# Altium project V2_UMRT_FlightComputer_Prototype_2019.PrjPcb
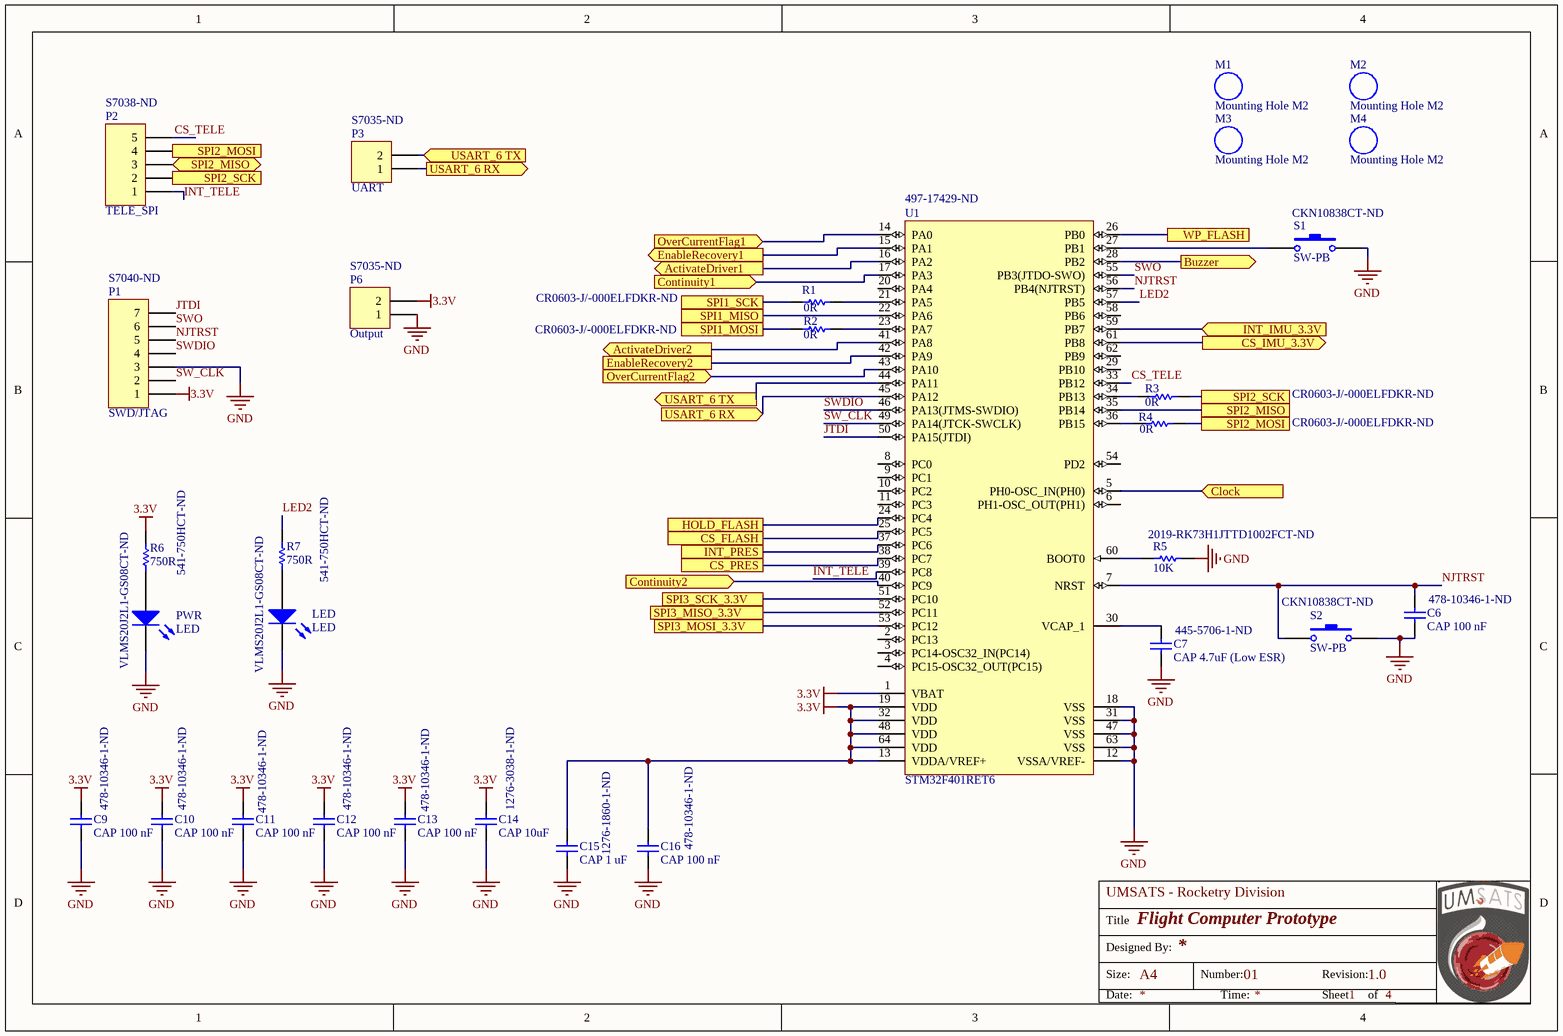
[diagram p0: Controller.SchDoc]
5 sheets, 97 parts. Net scope: flat (ports and power ports of the same name join across sheets).
Board file: PCB_Prototype.PcbDoc
Sheets:
  Controller.SchDoc
  UART-to-USB.SchDoc
  Sensors.SchDoc
  Recovery.SchDoc
  Misc.SchDoc

## Sheet Controller.SchDoc: Flight Computer Prototype
size A4; Organization: Altium Limited; Address1: L3, 12a Rodborough Rd; Address2: Frenchs Forest; Address3: NSW; Address4: Australia 2086; Revision: 1.0; SheetNumber: 1; SheetTotal: 4

### Parts
C6  CAP 100 nF  Supplier Part Number 1: 478-10346-1-ND  [06035C104KAT4A]
C7  CAP 4.7uF (Low ESR)  Supplier Part Number 1: 445-5706-1-ND  [CGA5L1X7R1E475K160AC]
C9  CAP 100 nF  Supplier Part Number 1: 478-10346-1-ND  [06035C104KAT4A]
C10  CAP 100 nF  Supplier Part Number 1: 478-10346-1-ND  [06035C104KAT4A]
C11  CAP 100 nF  Supplier Part Number 1: 478-10346-1-ND  [06035C104KAT4A]
C12  CAP 100 nF  Supplier Part Number 1: 478-10346-1-ND  [06035C104KAT4A]
C13  CAP 100 nF  Supplier Part Number 1: 478-10346-1-ND  [06035C104KAT4A]
C14  CAP 10uF  Supplier Part Number 1: 1276-3038-1-ND  [CL31A106KAHNFNE]
C15  CAP 1 uF  Supplier Part Number 1: 1276-1860-1-ND  [CL10A105KB8NNNC]
C16  CAP 100 nF  Supplier Part Number 1: 478-10346-1-ND  [06035C104KAT4A]
LED  LED  Supplier Part Number 1: VLMS20J2L1-GS08CT-ND  [Vishay VLMx20 Low Current Mini SMD LED]
M1  Mounting Hole M2  [Mounting Hole M2]
M2  Mounting Hole M2  [Mounting Hole M2]
M3  Mounting Hole M2  [Mounting Hole M2]
M4  Mounting Hole M2  [Mounting Hole M2]
P1  SWD/JTAG  Supplier Part Number 1: S7040-ND  [HDR1X7]
P2  TELE_SPI  Supplier Part Number 1: S7038-ND  [HDR1X5]
P3  UART  Supplier Part Number 1: S7035-ND  [HDR1X2]
P6  Output  Supplier Part Number 1: S7035-ND  [HDR1X2]
PWR  LED  Supplier Part Number 1: VLMS20J2L1-GS08CT-ND  [Vishay VLMx20 Low Current Mini SMD LED]
R1  0R  Supplier Part Number 1: CR0603-J/-000ELFDKR-ND  [CR0603-J/-000ELF]
R2  0R  Supplier Part Number 1: CR0603-J/-000ELFDKR-ND  [CR0603-J/-000ELF]
R3  0R  Supplier Part Number 1: CR0603-J/-000ELFDKR-ND  [CR0603-J/-000ELF]
R4  0R  Supplier Part Number 1: CR0603-J/-000ELFDKR-ND  [CR0603-J/-000ELF]
R5  10K  Supplier Part Number 1: 2019-RK73H1JTTD1002FCT-ND  [RK73H1JTTD1002F]
R6  750R  Supplier Part Number 1: 541-750HCT-ND  [CRCW0603750RFKEA]
R7  750R  Supplier Part Number 1: 541-750HCT-ND  [CRCW0603750RFKEA]
S1  SW-PB  Supplier Part Number 1: CKN10838CT-ND  [PTS530GG065SMTRLFS]
S2  SW-PB  Supplier Part Number 1: CKN10838CT-ND  [PTS530GG065SMTRLFS]
U1  STM32F401RET6  Supplier Part Number 1: 497-17429-ND  [STM-LQFP64_N]

### Ports
ActivateDriver1 (out), ActivateDriver2 (out), Buzzer (out), Clock (in), Continuity1 (in), Continuity2 (in), CS_FLASH, CS_IMU_3.3V (out), CS_PRES, EnableRecovery1 (out), EnableRecovery2, HOLD_FLASH, INT_IMU_3.3V (in), INT_PRES, OverCurrentFlag1 (in), OverCurrentFlag2 (in), SPI1_MISO, SPI1_MOSI, SPI1_SCK, SPI2_MISO, SPI2_MISO (bidir), SPI2_MOSI, SPI2_MOSI (in), SPI2_SCK, SPI2_SCK (in), SPI3_MISO_3.3V, SPI3_MOSI_3.3V, SPI3_SCK_3.3V, USART_6 RX (in), USART_6 RX (out), USART_6 TX (in), USART_6 TX (out), WP_FLASH

### Nets
3.3V: C9.1 C10.1 C11.1 C12.1 C13.1 C14.2 C15.1 C16.1 P1.1 P6.2 R6.2 U1.1(VBAT) U1.13(VDDA/VREF+) U1.19(VDD) U1.32(VDD) U1.48(VDD) U1.64(VDD)
GND: C6.2 C7.2 C9.2 C10.2 C11.2 C12.2 C13.2 C14.1 C15.2 C16.2 LED.2(K) P1.3 P6.1 PWR.2(K) R5.2 S1.2 S2.2 U1.12(VSSA/VREF-) U1.18(VSS) U1.31(VSS) U1.47(VSS) U1.63(VSS)
CS_TELE: P2.5 U1.33(PB12)
INT_TELE: P2.1 U1.39(PC8)
JTDI: P1.7 U1.50(PA15(JTDI))
LED2: R7.2 U1.57(PB5)
NJTRST: C6.1 P1.5 S2.1 U1.7(NRST) U1.56(PB4(NJTRST))
SW_CLK: P1.2 U1.49(PA14(JTCK-SWCLK))
SWDIO: P1.4 U1.46(PA13(JTMS-SWDIO))
SWO: P1.6 U1.55(PB3(JTDO-SWO))
NetC7_1: C7.1 U1.30(VCAP_1)
NetComp1_4: U1.17(PA3) ; port Continuity1
NetComp2_4: U1.40(PC9) ; port Continuity2
NetDriver1_1: U1.16(PA2) ; port ActivateDriver1
NetDriver1_2: U1.15(PA1) ; port EnableRecovery1
NetDriver1_3: U1.14(PA0) ; port OverCurrentFlag1
NetDriver2_1: U1.41(PA8) ; port ActivateDriver2
NetDriver2_2: U1.42(PA9) ; port EnableRecovery2
NetDriver2_3: U1.43(PA10) ; port OverCurrentFlag2
NetFLASH_1: U1.25(PC5) ; port CS_FLASH
NetFLASH_3: U1.26(PB0) ; port WP_FLASH
NetFLASH_5: R2.1 ; port SPI1_MOSI
NetFLASH_6: R1.1 ; port SPI1_SCK
NetFLASH_7: U1.24(PC4) ; port HOLD_FLASH
NetLED_1: LED.1(A) R7.1
NetP2_2: P2.2 R3.2 ; port SPI2_SCK
NetP2_3: P2.3 U1.35(PB14) ; port SPI2_MISO
NetP2_4: P2.4 R4.2 ; port SPI2_MOSI
NetP3_1: P3.1 U1.45(PA12) ; port USART_6 RX
NetP3_2: P3.2 U1.44(PA11) ; port USART_6 TX
NetPRES_6: U1.38(PC7) ; port CS_PRES
NetPRES_7: U1.37(PC6) ; port INT_PRES
NetPWR_1: PWR.1(A) R6.1
NetR1_2: R1.2 U1.21(PA5)
NetR2_2: R2.2 U1.23(PA7)
NetR3_1: R3.1 U1.34(PB13)
NetR4_1: R4.1 U1.36(PB15)
NetR5_1: R5.1 U1.60(BOOT0)
NetR12_2: U1.22(PA6) ; port SPI1_MISO
NetR33_1: U1.28(PB2) ; port Buzzer
NetS1_1: S1.1 U1.27(PB1)
NetU1_5: U1.5(PH0-OSC_IN(PH0)) ; port Clock
NetU1_51: U1.51(PC10) ; port SPI3_SCK_3.3V
NetU1_52: U1.52(PC11) ; port SPI3_MISO_3.3V
NetU1_53: U1.53(PC12) ; port SPI3_MOSI_3.3V
NetU1_59: U1.59(PB7) ; port INT_IMU_3.3V
NetU1_61: U1.61(PB8) ; port CS_IMU_3.3V

Not connected (* = marked no-connect by the designer): U1 2(PC13) 3(PC14-OSC32_IN(PC14)) 4(PC15-OSC32_OUT(PC15)) 6(PH1-OSC_OUT(PH1)) 8(PC0) 9(PC1) 10(PC2) 11(PC3) 20(PA4) 29(PB10) 54(PD2) 58(PB6) 62(PB9)

### Notes on the sheet
- Title
- UMSATS - Rocketry Division
- Designed By:
- Size:
- A4
- Number:
- 01
- Revision:
- Date:
- Time:
- Sheet
- of

### Library data of the parts
C6 C7 C9-C16 = Cap: Capacitor; Published: 8-Jun-2000; LatestRevisionDate: 17-Jul-2002; LatestRevisionNote: Re-released for DXP Platform.; Publisher: Altium Limited; Supplier 1: Digi-Key
  C14: PackageReference: RAD-0.3; PackageDescription: Radial Cap, Thru-Hole; 2 Leads; 0.3 in Pin Spacing; Value: 10uF
LED PWR = LED2: Typical RED, GREEN, YELLOW, AMBER GaAs LED; Published: 8-Jun-2000; LatestRevisionDate: 17-Jul-2002; LatestRevisionNote: Re-released for DXP Platform.; PackageVersion: Feb-2002; PackageReference: 3.2X1.6X1.1; Publisher: Altium Limited; PackageDescription: SM LED; 2 Flat Leads; Supplier 1: Digi-Key
P1 = Header 7: Header, 7-Pin; LatestRevisionDate: 17-Jul-2002; LatestRevisionNote: Re-released for DXP Platform.; Publisher: Altium Limited; Supplier 1: Digi-Key
P2 = Header 5: Header, 5-Pin; LatestRevisionDate: 17-Jul-2002; LatestRevisionNote: Re-released for DXP Platform.; Publisher: Altium Limited; Supplier 1: Digi-Key
P3 P6 = Header 2: Header, 2-Pin; LatestRevisionDate: 17-Jul-2002; LatestRevisionNote: Re-released for DXP Platform.; Publisher: Altium Limited; Supplier 1: Digi-Key
R1-R7 = Res1: Resistor; Value: 1K; Published: 8-Jun-2000; LatestRevisionDate: 17-Jul-2002; LatestRevisionNote: Re-released for DXP Platform.; PackageReference: AXIAL-0.3; Publisher: Altium Limited; PackageDescription: Axial Device, Thru-Hole; 2 Leads; 0.3 in Pin Spacing; Supplier 1: Digi-Key
S1 S2 = SW-PB: Switch; Published: 24-Mar-1999; LatestRevisionDate: 17-Jul-2002; LatestRevisionNote: Re-released for DXP Platform.; PackageReference: SPST-2; Publisher: Altium Limited; PackageDescription: Switch; 2 Leads; Supplier 1: Digi-Key
U1 = STM32F401RET6: ARM Cortex-M4 32-bit MCU+FPU, 512 KB Flash, 96 KB Internal RAM, 50 I/Os, 64-Pin LQFP, -40 to 85 degC, Tray; Supply Voltage(Vcc) min (V): 1.7; Internal RAM Size (kB): 96; I/Os (High Current): 50; Operating Frequency(F) (Processor speed) (MHz): 84; FLASH Size (Prog) (kB): 512; Package Reference: 64-Pin Low-profile Quad Flat Package, Body 10 x 10 mm, Pitch 0.5 mm; Packing: Tray; DatasheetVersion: Rev. 3; Mounting Technology: Surface Mount; ComponentLink1Description: Manufacturer URL; Package Description: LQFP64; Core: ARM Cortex-M4; ComponentLink1URL: http://www.st.com/; ComponentLink2URL: http://www.st.com/st-web-ui/static/active/en/resource/technical/document/datasheet/DM00102166.pdf; ComponentLink2Description: Datasheet; Supplier 1: Digi-Key

## Sheet UART-to-USB.SchDoc
size A
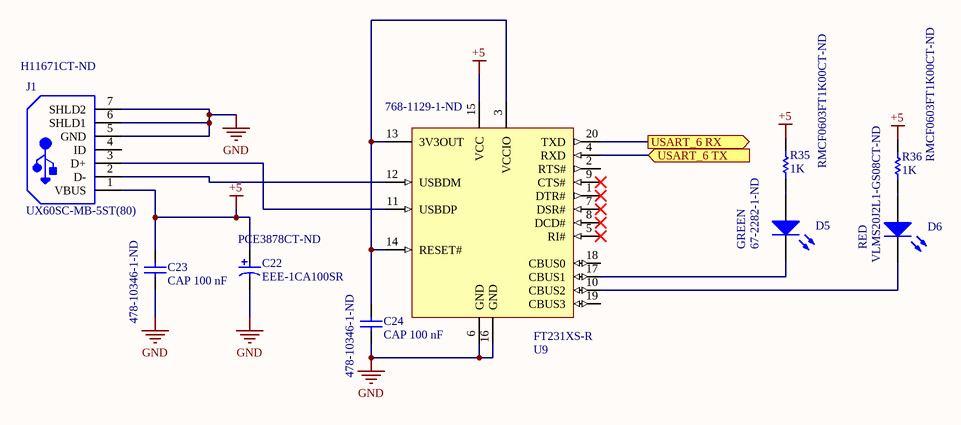
[diagram p1: UART-to-USB.SchDoc]

### Parts
C22  EEE-1CA100SR  Supplier Part Number 1: PCE3878CT-ND  [PNSC-EEE1CA100SR_L]
C23  CAP 100 nF  Supplier Part Number 1: 478-10346-1-ND  [06035C104KAT4A]
C24  CAP 100 nF  Supplier Part Number 1: 478-10346-1-ND  [06035C104KAT4A]
D5  GREEN  Supplier Part Number 1: 67-2282-1-ND  [Vishay VLMx20 Low Current Mini SMD LED]
D6  RED  Supplier Part Number 1: VLMS20J2L1-GS08CT-ND  [Vishay VLMx20 Low Current Mini SMD LED]
J1  UX60SC-MB-5ST(80)  Supplier Part Number 1: H11671CT-ND  [HIRO-UX60SC-MB-5ST(80)_V]
R35  1K  Supplier Part Number 1: RMCF0603FT1K00CT-ND  [CR0603-J/-000ELF]
R36  1K  Supplier Part Number 1: RMCF0603FT1K00CT-ND  [CR0603-J/-000ELF]
U9  FT231XS-R  Supplier Part Number 1: 768-1129-1-ND  [SSOP-20_L]

### Ports
USART_6 RX (out), USART_6 TX (in)

### Nets
+5: C22.1 C23.1 J1.1(VBUS) R35.2 R36.2 U9.15(VCC)
GND: C22.2 C23.2 C24.2 J1.5(GND) J1.6(SHLD1) J1.7(SHLD2) U9.6(GND) U9.16(GND)
NetC24_1: C24.1 U9.3(VCCIO) U9.13(3V3OUT) U9.14(RESET#)
NetD5_1: D5.1(A) R35.1
NetD5_2: D5.2(K) U9.17(CBUS1)
NetD6_1: D6.1(A) R36.1
NetD6_2: D6.2(K) U9.10(CBUS2)
NetJ1_2: J1.2(D-) U9.12(USBDM)
NetJ1_3: J1.3(D+) U9.11(USBDP)
NetP3_1: U9.20(TXD) ; port USART_6 RX
NetP3_2: U9.4(RXD) ; port USART_6 TX

Not connected (* = marked no-connect by the designer): J1 4(ID); U9 1(DTR#)* 2(RTS#) 5(RI#)* 7(DSR#)* 8(DCD#)* 9(CTS#)* 18(CBUS0) 19(CBUS3)

### Library data of the parts
C22 = CMP-2000-06199-1: Aluminum Electrolytic Capacitor, 10 uF, +/- 20%, -40 to 85 degC, 2-Pin SMD, RoHS, Tape and Reel; Manufacturer: Panasonic; Lead Length: 1.8mm; No. of Pins: 2; Ripple Current Frequency: 120Hz; Ripple Current Temperature: 85°C; External Depth: 4.3mm; Operating Lifetime: 2000h; Power Factor: 0.16; Lead Cross-section Width: 0.65mm; Product Range: PANASONIC-SSeries; Voltage Rating V DC: 16V; Leakage Current: 3µA; Ripple Current AC: 28mA; AE Capacitor Case: RadialCan-SMD; Capacitance: 10µF; Lifetime @ Temperature: 2000hours@85°C; External Length / Height: 5.4mm; SVHC: NoSVHC(16-Dec-2013); Packaging: CutTape; Series: VS; Package Description: 2-Pin Surface Mount Device, Body 4.5 x 4.5 mm; Tolerance -: 20%; Capacitor Terminals: SMD; Lead Spacing: 1mm; Package / Case: B; Capacitance Tolerance: ±20%; Operating life Time: 2000h; Tape Width: 12mm; Power Factor Frequency: 120Hz; Voltage Rating: 16V; Diameter: 4mm; Operating Temperature Max: 85°C; Datasheet URL: https://datasheet.ciiva.com/19458/1355487-19458346.pdf; Capacitor Mounting: SMD; External Width: 4.3mm; Operating Life Temperature: 85°C; Capacitance Tolerance ±: ±20%; Package Reference: EEE1CA100SR; AC Ripple Current: 28mA; Tolerance +: 20%; Height: 5.4mm; Datasheet Version: 04/2005; Operating Temperature Min: -40°C; Capacitor Case Style: RadialCan-SMD; Mounting Technology: SurfaceMount; Operating Temperature Range: -40°Cto+85°C; Manufacturer URL: http://www.panasonic.com/; Life Time @ Temperature: 2000hours@85°C; Supplier 1: Digi-Key
C23 C24 = Cap: Capacitor; Published: 8-Jun-2000; LatestRevisionDate: 17-Jul-2002; LatestRevisionNote: Re-released for DXP Platform.; Publisher: Altium Limited; Supplier 1: Digi-Key
D5 D6 = LED2: as LED on sheet Controller; Published: 8-Jun-2000; LatestRevisionDate: 17-Jul-2002; LatestRevisionNote: Re-released for DXP Platform.; PackageVersion: Feb-2002; PackageReference: 3.2X1.6X1.1; Publisher: Altium Limited; PackageDescription: SM LED; 2 Flat Leads; Supplier 1: Digi-Key
J1 = CMP-2000-07376-1: Mini-B Connector, SMT Mount Receptacle Meeting Requirement of USB 2.0 Standard, 5 V, 1 A, -30 to 75 degC, 5-Pin SMD, RoHS, Tape and Reel; Manufacturer: Hirose Electric; Product Length (mm): 7.7mm; Voltage Rating Max: 5VAC; Number of Contacts: 5POS; Number of Ports: 1Port; Product Height (mm): 3.95mm; Product Depth (mm): 7mm; Pitch (mm): 0.8mm; Gender: RCP; Current Rating (Max): 1A; DELETED: Compliant; Product Diameter (mm): NotRequiredmm; Body Orientation: RightAngle; Operating Temp Range: -30Cto75C; Packaging: TapeandReel; Termination Method: Solder; Number of Terminals: 5; Package Description: 5-Pin Surface Mount Device, Body 7.7 x 7 mm, Pitch 0.8 mm; Mounting Technology: SurfaceMount; Contact Material: CopperAlloy; Package Reference: UX60SC-MB-5ST(80); Operating Temperature Min Deg. C: -30C; Housing Material: Synthetic; Operating Temperature Max Deg. C: 75C; Manufacturer URL: https://www.hirose.com; Datasheet Version: 04/2008; Type: Mini-USB; Datasheet URL: https://datasheet.ciiva.com/4598/e24000153-34949-4598883.pdf; Contact Plating: Gold; Mounting Style: ThroughHole; Supplier 1: Digi-Key
R35 R36 = Res1: Resistor; Published: 8-Jun-2000; LatestRevisionDate: 17-Jul-2002; LatestRevisionNote: Re-released for DXP Platform.; PackageReference: AXIAL-0.3; Publisher: Altium Limited; PackageDescription: Axial Device, Thru-Hole; 2 Leads; 0.3 in Pin Spacing; Value: 1K; Supplier 1: Digi-Key
U9 = CMP-0248-00024-2: USB to Full-Handshake UART Interface Chip, UHCI/OHCI/EHCI Compatible, USB 2.0 Compatible, -40 to +85 degC, 20-Pin SSOP, Pb-Free, Tape and Reel; Manufacturer: FTDI; PackageVersion: Feb-13; PackageReference: SSOP-20; ComponentLink1Description: Manufacturer URL; ComponentLink2Description: Datasheet; PackageDescription: 20-Pin Small Outline Package, 8.6 x 3.9 mm Body, 0.635 mm Pitch; ComponentLink3URL: www.ftdichip.com/Products/ICs/FT231X.html; PartNumber: FT231XS-R; DatasheetVersion: ver 1.2, Feb-2013; ComponentLink2URL: http://www.ftdichip.com/Support/Documents/DataSheets/ICs/DS_FT231X.pdf; Code_JEDEC: MO-137-AD; ComponentLink3Description: FT231X Product Page; RevisionNote: DatasheetVersion updated to 1.2 Feb-2013; ComponentLink1URL: http://www.ftdichip.com/; Supplier 1: Digi-Key

## Sheet Sensors.SchDoc: Flight Computer Prototype
size A4; Organization: Altium Limited; Address1: L3, 12a Rodborough Rd; Address2: Frenchs Forest; Address3: NSW; Address4: Australia 2086; Revision: 1.0; SheetNumber: 2; SheetTotal: 4
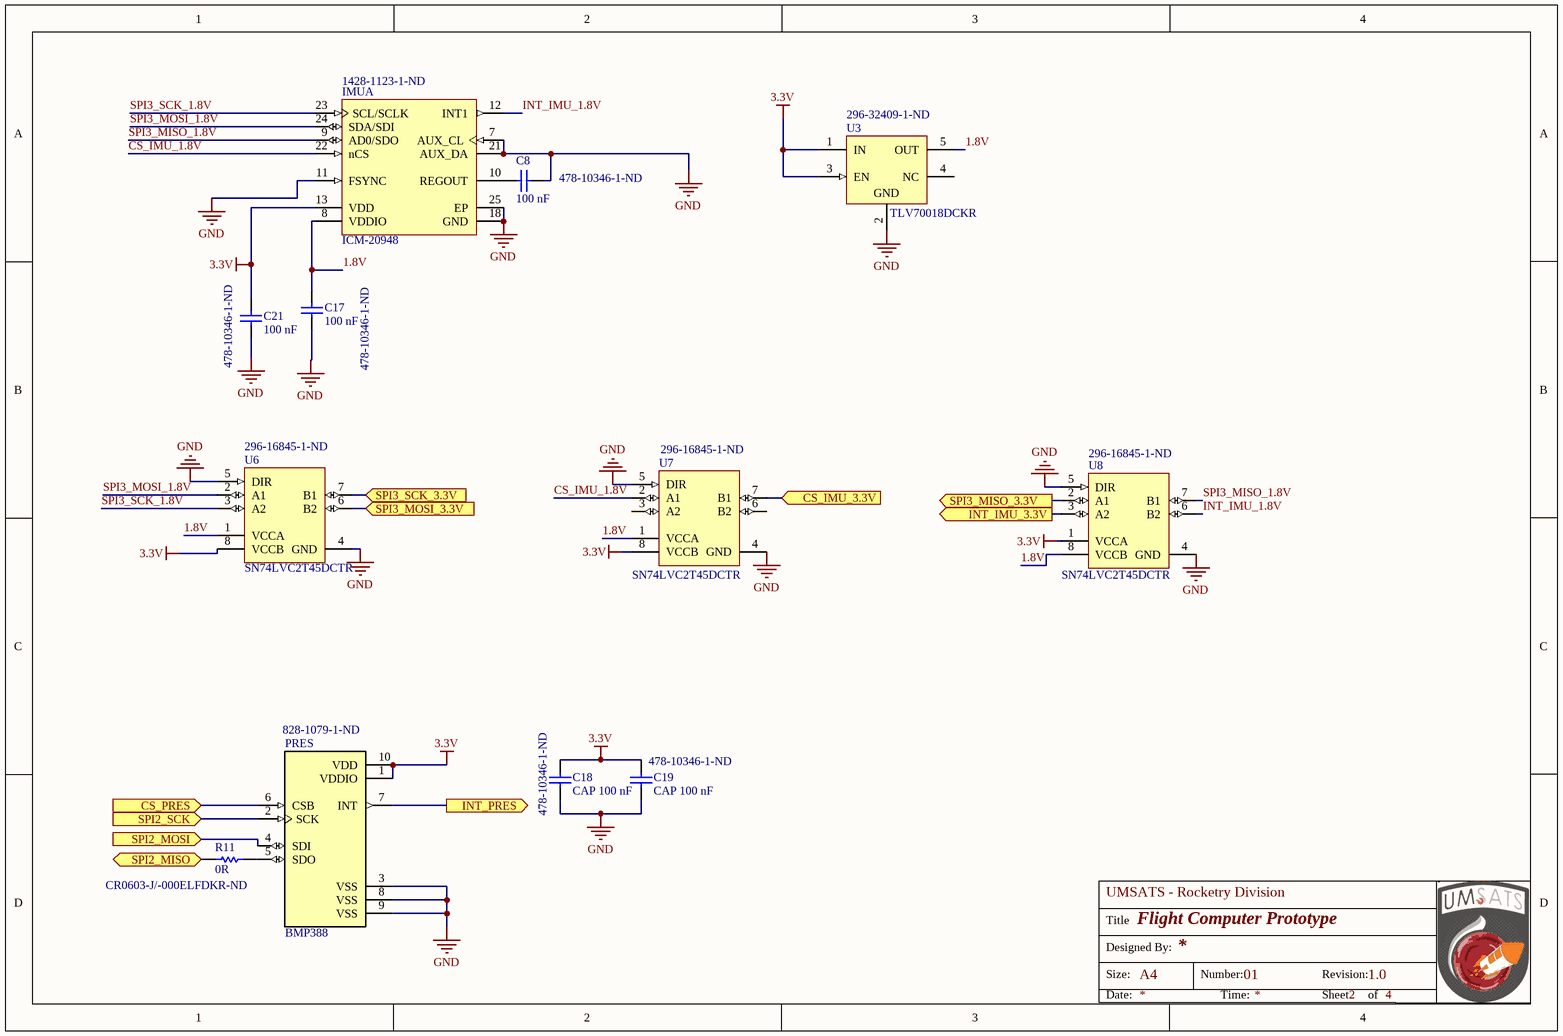
[diagram p2: Sensors.SchDoc]

### Parts
C8  100 nF  Supplier Part Number 1: 478-10346-1-ND  [CAPC1608X90X35ML15T15]
C17  100 nF  Supplier Part Number 1: 478-10346-1-ND  [CAPC1608X90X35ML15T15]
C18  CAP 100 nF  Supplier Part Number 1: 478-10346-1-ND  [06035C104KAT4A]
C19  CAP 100 nF  Supplier Part Number 1: 478-10346-1-ND  [06035C104KAT4A]
C21  100 nF  Supplier Part Number 1: 478-10346-1-ND  [CAPC1608X90X35ML15T15]
IMU  ICM-20948  Supplier Part Number 1: 1428-1123-1-ND  [TDK-QFN-24_L]  (part A of 2)
PRES  BMP388  Supplier Part Number 1: 828-1079-1-ND  [*PQFN50P200X200X80-10N]
R11  0R  Supplier Part Number 1: CR0603-J/-000ELFDKR-ND  [CR0603-J/-000ELF]
U3  TLV70018DCKR  Supplier Part Number 1: 296-32409-1-ND  [DCK0005A_N]
U6  SN74LVC2T45DCTR  Supplier Part Number 1: 296-16845-1-ND  [DCU0008A_N]
U7  SN74LVC2T45DCTR  Supplier Part Number 1: 296-16845-1-ND  [DCU0008A_N]
U8  SN74LVC2T45DCTR  Supplier Part Number 1: 296-16845-1-ND  [DCU0008A_N]

### Ports
CS_IMU_3.3V (in), CS_PRES (in), INT_IMU_3.3V (out), INT_PRES (out), SPI2_MISO (bidir), SPI2_MOSI (in), SPI2_SCK (in), SPI3_MISO_3.3V (out), SPI3_MOSI_3.3V (in), SPI3_SCK_3.3V (in)

### Nets
3.3V: C18.1 C19.1 C21.2 IMU.13(VDD) PRES.1(VDDIO) PRES.10(VDD) U3.1(IN) U3.3(EN) U6.8(VCCB) U7.8(VCCB) U8.1(VCCA)
GND: C8.2 C17.1 C18.2 C19.2 C21.1 IMU.7(AUX_CL) IMU.11(FSYNC) IMU.18(GND) IMU.21(AUX_DA) IMU.25(EP) PRES.3(VSS) PRES.8(VSS) PRES.9(VSS) U3.2(GND) U6.4(GND) U6.5(DIR) U7.4(GND) U7.5(DIR) U8.4(GND) U8.5(DIR)
1.8V: C17.2 IMU.8(VDDIO) U3.5(OUT) U6.1(VCCA) U7.1(VCCA) U8.8(VCCB)
CS_IMU_1.8V: IMU.22(nCS) U7.2(A1)
INT_IMU_1.8V: IMU.12(INT1) U8.6(B2)
SPI3_MISO_1.8V: IMU.9(AD0/SDO) U8.7(B1)
SPI3_MOSI_1.8V: IMU.24(SDA/SDI) U6.2(A1)
SPI3_SCK_1.8V: IMU.23(SCL/SCLK) U6.3(A2)
NetC8_1: C8.1 IMU.10(REGOUT)
NetP2_2: PRES.2(SCK) ; port SPI2_SCK
NetP2_3: R11.1 ; port SPI2_MISO
NetP2_4: PRES.4(SDI) ; port SPI2_MOSI
NetPRES_5: PRES.5(SDO) R11.2
NetPRES_6: PRES.6(CSB) ; port CS_PRES
NetPRES_7: PRES.7(INT) ; port INT_PRES
NetU1_51: U6.7(B1) ; port SPI3_SCK_3.3V
NetU1_52: U8.2(A1) ; port SPI3_MISO_3.3V
NetU1_53: U6.6(B2) ; port SPI3_MOSI_3.3V
NetU1_59: U8.3(A2) ; port INT_IMU_3.3V
NetU1_61: U7.7(B1) ; port CS_IMU_3.3V

Not connected (* = marked no-connect by the designer): U3 4(NC); U7 3(A2) 6(B2)

### Notes on the sheet
- Title
- UMSATS - Rocketry Division
- Designed By:
- Size:
- A4
- Number:
- 01
- Revision:
- Date:
- Time:
- Sheet
- of

### Library data of the parts
C8 C17 C21 = CMP-2006-04388-1: Part Number: 06035C104K4Z2A; Manufacturer: AVX Interconnect / Elco; Supplier 1: Digi-Key
C18 C19 = Cap: Capacitor; Published: 8-Jun-2000; LatestRevisionDate: 17-Jul-2002; LatestRevisionNote: Re-released for DXP Platform.; Publisher: Altium Limited; Supplier 1: Digi-Key
IMU = CMP-2000-07532-1: World’s Lowest Power 9-Axis MEMS MotionTracking(TM) Device, 1.71 to 3.6 V, -40 to 85 degC, 24-Pin QFN, RoHS, Tape and Reel; Manufacturer: TDK; Package Description: 24-Pin Quad Flat No-lead Package, Body 3 x 3 mm, Pitch 0.4 mm; Datasheet Version: Rev. 1.3, 06/2017; Package Reference: QFN-24; Mounting Technology: SurfaceMount; Datasheet URL: https://www.invensense.com/wp-content/uploads/2016/06/DS-000189-ICM-20948-v1.3.pdf; Manufacturer URL: http://www.tdk.com/; Supplier 1: Digi-Key
PRES = BMP388: P-Sensor SPI I2C 1, 25 Bar SMD; MF: Bosch Sensortec; Package: WFLGA-10 Bosch Tools; SnapEDA_Link: https://www.snapeda.com/parts/BMP388/Bosch%20Sensortec/view-part/?ref=snap; MP: BMP388; Availability: Unavailable; Price: None; Value: *; Supplier 1: Digi-Key
R11 = Res1: Resistor; Value: 1K; Published: 8-Jun-2000; LatestRevisionDate: 17-Jul-2002; LatestRevisionNote: Re-released for DXP Platform.; PackageReference: AXIAL-0.3; Publisher: Altium Limited; PackageDescription: Axial Device, Thru-Hole; 2 Leads; 0.3 in Pin Spacing; Supplier 1: Digi-Key
U3 = CMP-0394-00928-2: Single Output LDO, 200 mA, Fixed 1.8 V Output, 2 to 5.5 V Input, with Low IQ, 5-pin SC70 (DCK), -40 to 125 degC, Green (RoHS & no Sb/Br); Manufacturer: Texas Instruments; Vout Adj(Max)(V): 1.8; Vin(Max)(V): 5.5; SubFamily: Single Channel LDO; Iout(Max)(A): 0.2; Iq(Typ)(mA): 0.03; Accuracy(%): 2; Vdo(Typ)(mV): 175; PartNumber: TLV70018DCKR; ComponentLink3URL: http://www.ti.com/litv/pdf/mpds025f; ComponentLink1URL: http://www.ti.com/; PackageDescription: 5-Pin Plastic Small-Outline, Body 2 x 1.25 mm, Pitch 0.65 mm; DatasheetVersion: SLVSA00D; Eco-Plan: Green (RoHS & no Sb/Br); Mounting Technology: Surface Mount; ComponentLink2URL: http://www.ti.com/general/docs/lit/getliterature.tsp?genericPartNumber=TLV70018&fileType=pdf; ComponentLink3Description: Package Specification; Vout Adj(Min)(V): 1.8; ComponentLink1Description: Manufacturer URL; Code_JEDEC: MO-203; PackageReference: DCK0005A; ComponentLink2Description: Datasheet; Vin(Min)(V): 2; PackageVersion: 4093553-3/G; Fixed Output Options(V): 1.8; Supplier 1: Digi-Key
U6-U8 = CMP-0859-00011-4: Dual-Bit Dual Supply Transceiver with Configurable Voltage Translation and 3-State Outputs, DCU0008A, LARGE T&R; Manufacturer: Texas Instruments; Rating: Military; Output Type: CMOS; VCC(Max)(V): 5.5; tpd @ Nom Voltage(Max)(ns): 17.7,10.3,8.3,7.2; Technology Family: LVC; Schmitt Trigger: No; ICC @ Nom Voltage(Max)(mA): 0.004; Sub-Family: Dual Supply Translator; F @ Nom Voltage(Max)(Mhz): 150; Voltage(Nom)(V): 1.8,2.5,3.3,5; 3-State Output: Yes; Logic: True; Output Drive (IOL/IOH)(Max)(mA): 32/-32; Bits(#): 2; Input Type: CMOS/TTL; VCC(Min)(V): 1.65; DatasheetVersion: SCES516J; Operating Temperature Range(C): -40 to 85; Generic Part Number: SN74LVC2T45; PackageReference: DCU0008A; Supplier 1: Digi-Key

## Sheet Recovery.SchDoc: Flight Computer Prototype
size A4; Organization: Altium Limited; Address1: L3, 12a Rodborough Rd; Address2: Frenchs Forest; Address3: NSW; Address4: Australia 2086; Revision: 1.0; SheetNumber: 3; SheetTotal: 4
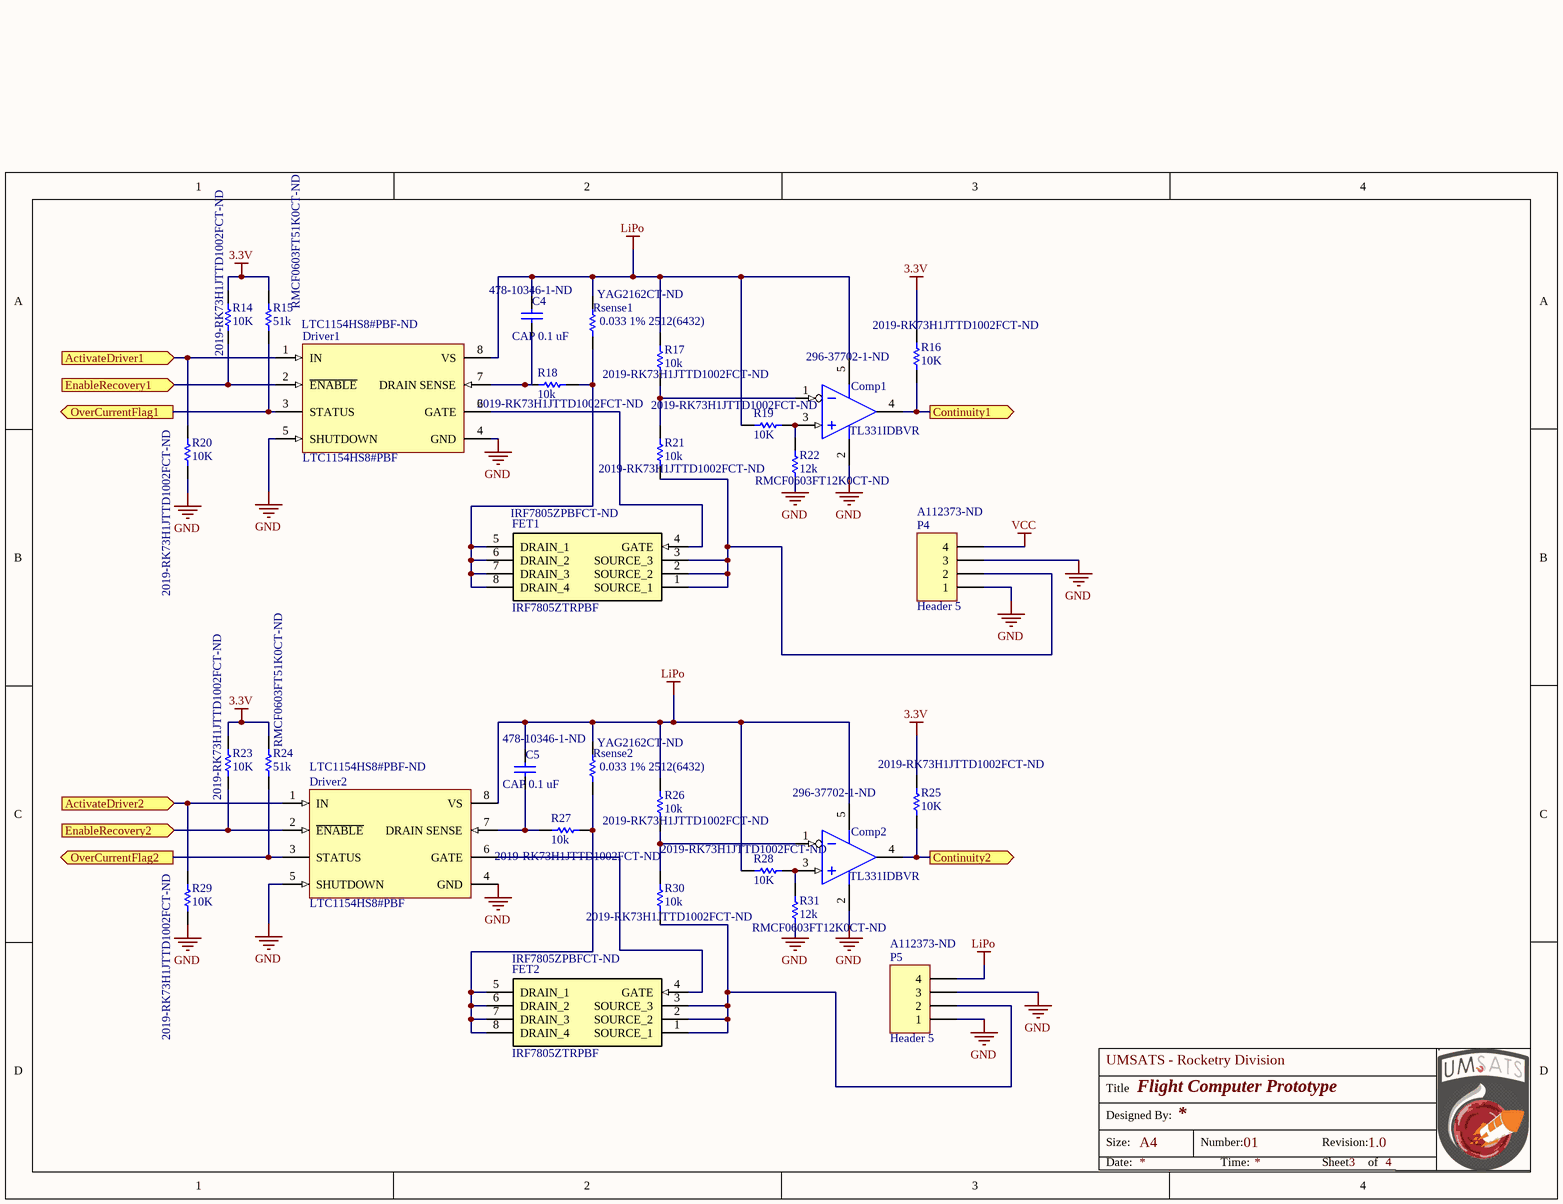
[diagram p3: Recovery.SchDoc]

### Parts
C4  CAP 0.1 uF  Supplier Part Number 1: 478-10346-1-ND  [06035C104KAT4A]
C5  CAP 0.1 uF  Supplier Part Number 1: 478-10346-1-ND  [06035C104KAT4A]
Comp1  TL331IDBVR  Supplier Part Number 1: 296-37702-1-ND  [DBV0005A_M]
Comp2  TL331IDBVR  Supplier Part Number 1: 296-37702-1-ND  [DBV0005A_M]
Driver1  LTC1154HS8#PBF  Supplier Part Number 1: LTC1154HS8#PBF-ND  [LT-S8-8_N]
Driver2  LTC1154HS8#PBF  Supplier Part Number 1: LTC1154HS8#PBF-ND  [LT-S8-8_N]
FET1  IRF7805ZTRPBF  Supplier Part Number 1: IRF7805ZPBFCT-ND  [SOIC127P600X165-8N]
FET2  IRF7805ZTRPBF  Supplier Part Number 1: IRF7805ZPBFCT-ND  [SOIC127P600X165-8N]
P4  Header 5  Supplier Part Number 1: A112373-ND  [BarrierBlock]
P5  Header 5  Supplier Part Number 1: A112373-ND  [BarrierBlock]
R14  10K  Supplier Part Number 1: 2019-RK73H1JTTD1002FCT-ND  [RK73H1JTTD1002F]
R15  51k  Supplier Part Number 1: RMCF0603FT51K0CT-ND  [RK73H1JTTD1002F]
R16  10K  Supplier Part Number 1: 2019-RK73H1JTTD1002FCT-ND  [RK73H1JTTD1002F]
R17  10k  Supplier Part Number 1: 2019-RK73H1JTTD1002FCT-ND  [RK73H1JTTD1002F]
R18  10k  Supplier Part Number 1: 2019-RK73H1JTTD1002FCT-ND  [RK73H1JTTD1002F]
R19  10K  Supplier Part Number 1: 2019-RK73H1JTTD1002FCT-ND  [RK73H1JTTD1002F]
R20  10K  Supplier Part Number 1: 2019-RK73H1JTTD1002FCT-ND  [RK73H1JTTD1002F]
R21  10k  Supplier Part Number 1: 2019-RK73H1JTTD1002FCT-ND  [RK73H1JTTD1002F]
R22  12k  Supplier Part Number 1: RMCF0603FT12K0CT-ND  [RK73H1JTTD1002F]
R23  10K  Supplier Part Number 1: 2019-RK73H1JTTD1002FCT-ND  [RK73H1JTTD1002F]
R24  51k  Supplier Part Number 1: RMCF0603FT51K0CT-ND  [RK73H1JTTD1002F]
R25  10K  Supplier Part Number 1: 2019-RK73H1JTTD1002FCT-ND  [RK73H1JTTD1002F]
R26  10k  Supplier Part Number 1: 2019-RK73H1JTTD1002FCT-ND  [RK73H1JTTD1002F]
R27  10k  Supplier Part Number 1: 2019-RK73H1JTTD1002FCT-ND  [RK73H1JTTD1002F]
R28  10K  Supplier Part Number 1: 2019-RK73H1JTTD1002FCT-ND  [RK73H1JTTD1002F]
R29  10K  Supplier Part Number 1: 2019-RK73H1JTTD1002FCT-ND  [RK73H1JTTD1002F]
R30  10k  Supplier Part Number 1: 2019-RK73H1JTTD1002FCT-ND  [RK73H1JTTD1002F]
R31  12k  Supplier Part Number 1: RMCF0603FT12K0CT-ND  [RK73H1JTTD1002F]
Rsense1  0.033 1% 2512(6432)  Supplier Part Number 1: YAG2162CT-ND  [RESC2512(6432)_N]
Rsense2  0.033 1% 2512(6432)  Supplier Part Number 1: YAG2162CT-ND  [RESC2512(6432)_N]

### Ports
ActivateDriver1 (in), ActivateDriver2 (in), Continuity1 (out), Continuity2 (out), EnableRecovery1 (in), EnableRecovery2 (in), OverCurrentFlag1 (out), OverCurrentFlag2 (out)

### Nets
3.3V: R14.2 R15.2 R16.2 R23.2 R24.2 R25.2
GND: Comp1.2(VCC-/GND) Comp2.2(VCC-/GND) Driver1.4(GND) Driver1.5(SHUTDOWN) Driver2.4(GND) Driver2.5(SHUTDOWN) P4.1 P4.3 P5.1 P5.3 R20.1 R22.1 R29.1 R31.1
LiPo: C4.1 C5.1 Comp1.5(VCC) Comp2.5(VCC) Driver1.8(VS) Driver2.8(VS) P5.4 R17.2 R19.2 R26.2 R28.2 Rsense1.2 Rsense2.2
VCC: P4.4
NetC4_2: C4.2 Driver1.7(DRAIN_SENSE) R18.2
NetC5_2: C5.2 Driver2.7(DRAIN_SENSE) R27.2
NetComp1_1: Comp1.1(IN-) R17.1 R21.2
NetComp1_3: Comp1.3(IN+) R19.1 R22.2
NetComp1_4: Comp1.4(OUT) R16.1 ; port Continuity1
NetComp2_1: Comp2.1(IN-) R26.1 R30.2
NetComp2_3: Comp2.3(IN+) R28.1 R31.2
NetComp2_4: Comp2.4(OUT) R25.1 ; port Continuity2
NetDriver1_1: Driver1.1(IN) R20.2 ; port ActivateDriver1
NetDriver1_2: Driver1.2(~{ENABLE}) R14.1 ; port EnableRecovery1
NetDriver1_3: Driver1.3(STATUS) R15.1 ; port OverCurrentFlag1
NetDriver1_6: Driver1.6(GATE) FET1.4(GATE)
NetDriver2_1: Driver2.1(IN) R29.2 ; port ActivateDriver2
NetDriver2_2: Driver2.2(~{ENABLE}) R23.1 ; port EnableRecovery2
NetDriver2_3: Driver2.3(STATUS) R24.1 ; port OverCurrentFlag2
NetDriver2_6: Driver2.6(GATE) FET2.4(GATE)
NetFET1_1: FET1.1(SOURCE_1) FET1.2(SOURCE_2) FET1.3(SOURCE_3) P4.2 R21.1
NetFET1_5: FET1.5(DRAIN_1) FET1.6(DRAIN_2) FET1.7(DRAIN_3) FET1.8(DRAIN_4) R18.1 Rsense1.1
NetFET2_1: FET2.1(SOURCE_1) FET2.2(SOURCE_2) FET2.3(SOURCE_3) P5.2 R30.1
NetFET2_5: FET2.5(DRAIN_1) FET2.6(DRAIN_2) FET2.7(DRAIN_3) FET2.8(DRAIN_4) R27.1 Rsense2.1

### Notes on the sheet
- Title
- UMSATS - Rocketry Division
- Designed By:
- Size:
- A4
- Number:
- 01
- Revision:
- Date:
- Time:
- Sheet
- of

### Library data of the parts
C4 C5 = Cap: Capacitor; Published: 8-Jun-2000; LatestRevisionDate: 17-Jul-2002; LatestRevisionNote: Re-released for DXP Platform.; Publisher: Altium Limited; Supplier 1: Digi-Key
Comp1 Comp2 = CMP-2000-04959-1: Single Differential Comparator, 2 to 36 V, -40 to 125 degC, 5-Pin SOT-23, Green (RoHS & no Sb/Br), Tape and Reel; Manufacturer: TexasInstruments; Output Type: OpenCollector; Typical Voltage Gain: 106.02dB; Maximum Single Supply Voltage: 36V; Number of Channels per Chip: 1; Package Version: 4073253-4/N, 12/2014; Maximum Dual Supply Voltage: ±18V; Typical Response Time: 1.3us; Minimum Single Supply Voltage: 2V; Minimum Dual Supply Voltage: ±1V; Operating Temperature: -40to85degC; Category: Comparator; Datasheet Version: Rev. G, 02/2016; Strobe Capability: No; Rad Hard: No; Manufacturer URL: http://www.ti.com/; Datasheet URL: http://www.ti.com/general/docs/lit/getliterature.tsp?genericPartNumber=TL331&fileType=pdf; Packaging: Tape&Reel; Mounting: SurfaceMount; Rail to Rail: No; Package Reference: DBV5; Package: 5SOT-23; Package Description: 5-Pin Small Outline Transistor, Body 2.9 x 1.6 mm, Pitch 0.95 mm; Package URL: http://www.ti.com/lit/ml/mpds018l/mpds018l.pdf; Supplier 1: Digi-Key
Driver1 Driver2 = CMP-0479-00484-1: High-Side Micropower MOSFET Driver, 22 V Vin MAX, 8-pin SOIC (S8-8), -40 to 150 degC, Pb-Free; Manufacturer: Linear Technology; ComponentLink1Description: Manufacturer URL; DatasheetVersion: Rev. B; PackageDescription: 8-Pin Plastic Small Outline (Narrow .150 Inch), Body 4.9 x 3.9 mm, Pitch 1.27 mm; RoHS: TRUE; PartNumber: LTC1154HS8#PBF; PackageReference: S8-8; ComponentLink3Description: Package Specification; ComponentLink2URL: http://cds.linear.com/docs/en/datasheet/1154fb.pdf; Mounting Technology: Surface Mount; ComponentLink1URL: http://www.linear.com/; ComponentLink3URL: http://cds.linear.com/docs/en/packaging/05081610_G_SO8.pdf; ComponentLink2Description: Datasheet; PackageVersion: Rev. G, 03/2012; Supplier 1: Digi-Key
FET1 FET2 = RSS100N03FRATB: MOSFET (N-Channel); Manufacturer_Name: ROHM Semiconductor; Datasheet Link: https://componentsearchengine.com/Datasheets/1/RSS100N03FRATB.pdf; Height: 1.65mm; Manufacturer_Part_Number: RSS100N03FRATB; Mouser Part Number: 755-RSS100N03FRATB; Mouser Price/Stock: https://www.mouser.com/Search/Refine.aspx?Keyword=755-RSS100N03FRATB; Supplier 1: Digi-Key
P4 P5 = Header 4: Header, 4-Pin; LatestRevisionDate: 17-Jul-2002; LatestRevisionNote: Re-released for DXP Platform.; Publisher: Altium Limited; Supplier 1: Digi-Key
R14-R31 = Res1: Resistor; Value: 1K; Published: 8-Jun-2000; LatestRevisionDate: 17-Jul-2002; LatestRevisionNote: Re-released for DXP Platform.; PackageReference: AXIAL-0.3; Publisher: Altium Limited; PackageDescription: Axial Device, Thru-Hole; 2 Leads; 0.3 in Pin Spacing; Supplier 1: Digi-Key
Rsense1 Rsense2 = CMP-1018-00955-1: 8M66 1W 1% 2512 (6432 Metric)  SMD; Case-EIA: 2512; Case-Metric: 6432; Value: 8660000.00 Ohm; Power: 1 W; Technology: SMT; Tolerance: 1 %; Supplier 1: Digi-Key

## Sheet Misc.SchDoc: Flight Computer Prototype
size A4; Organization: Altium Limited; Address1: L3, 12a Rodborough Rd; Address2: Frenchs Forest; Address3: NSW; Address4: Australia 2086; Revision: 1.0; SheetNumber: 4; SheetTotal: 4
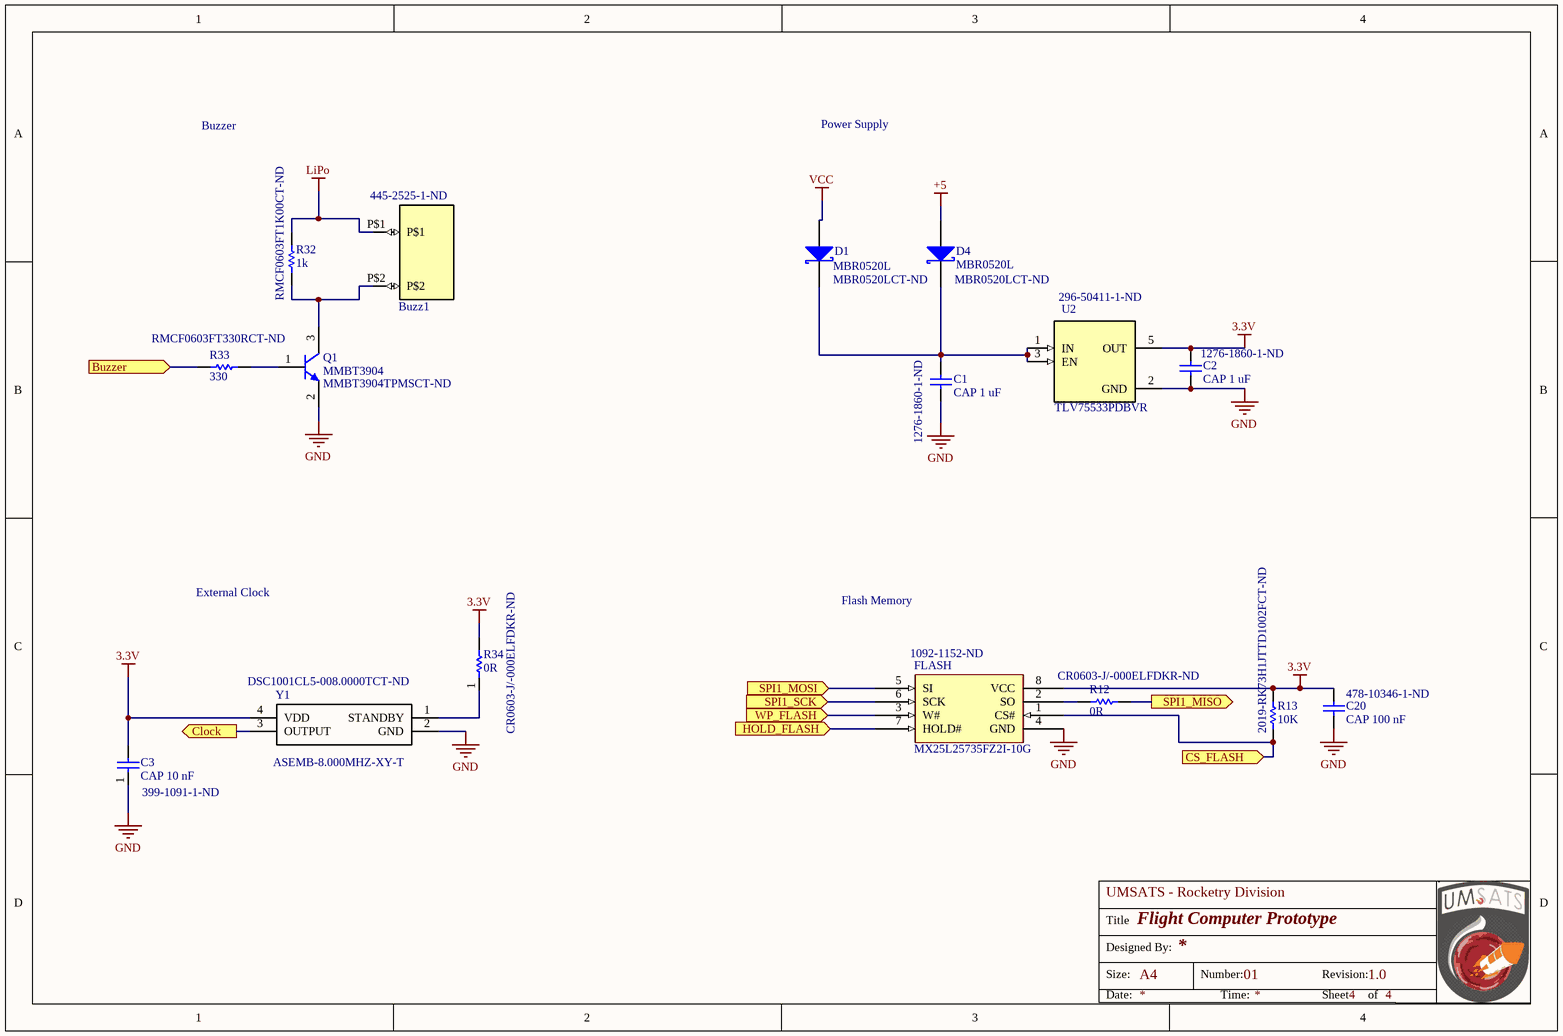
[diagram p4: Misc.SchDoc]

### Parts
Buzz1  Supplier Part Number 1: 445-2525-1-ND  [*PS1240P02BT_PS1240P02BT(Primary)]  (hidden comment: PS1240P02BT)
C1  CAP 1 uF  Supplier Part Number 1: 1276-1860-1-ND  [CL10A105KB8NNNC]
C2  CAP 1 uF  Supplier Part Number 1: 1276-1860-1-ND  [CL10A105KB8NNNC]
C3  CAP 10 nF  Supplier Part Number 1: 399-1091-1-ND  [06035C104KAT4A]
C20  CAP 100 nF  Supplier Part Number 1: 478-10346-1-ND  [06035C104KAT4A]
D1  MBR0520L  Supplier Part Number 1: MBR0520LCT-ND  [ON_Semi_CASE_425_0]
D4  MBR0520L  Supplier Part Number 1: MBR0520LCT-ND  [ON_Semi_CASE_425_0]
FLASH  MX25L25735FZ2I-10G  Supplier Part Number 1: 1092-1152-ND  [SON127P800X80_HS-9N]
Q1  MMBT3904  Supplier Part Number 1: MMBT3904TPMSCT-ND  [FAIR-SOT23-3_V]
R12  0R  Supplier Part Number 1: CR0603-J/-000ELFDKR-ND  [CR0603-J/-000ELF]
R13  10K  Supplier Part Number 1: 2019-RK73H1JTTD1002FCT-ND  [RK73H1JTTD1002F]
R32  1k  Supplier Part Number 1: RMCF0603FT1K00CT-ND  [CR0603-J/-000ELF]
R33  330  Supplier Part Number 1: RMCF0603FT330RCT-ND  [CR0603-J/-000ELF]
R34  0R  Supplier Part Number 1: CR0603-J/-000ELFDKR-ND  [CR0603-J/-000ELF]
U2  TLV75533PDBVR  Supplier Part Number 1: 296-50411-1-ND  [SOT95P280X145-5N]
Y1  ASEMB-8.000MHZ-XY-T  Supplier Part Number 1: DSC1001CL5-008.0000TCT-ND  [ASEMB]

### Ports
Buzzer (in), Clock (out), CS_FLASH (in), HOLD_FLASH (in), SPI1_MISO (out), SPI1_MOSI (in), SPI1_SCK (in), WP_FLASH (in)

### Nets
3.3V: C2.1 C3.2 C20.1 FLASH.8(VCC) R13.2 R34.2 U2.5(OUT) Y1.4(VDD)
+5: D4.1(A)
GND: C1.2 C2.2 C3.1 C20.2 FLASH.4(GND) Q1.2(E) U2.2(GND) Y1.2(GND)
LiPo: Buzz1.P$1 R32.2
VCC: D1.1(A)
NetBuzz1_P$2: Buzz1.P$2 Q1.3(C) R32.1
NetC1_1: C1.1 D1.2(K) D4.2(K) U2.1(IN) U2.3(EN)
NetFLASH_1: FLASH.1(CS#) R13.1 ; port CS_FLASH
NetFLASH_2: FLASH.2(SO) R12.1
NetFLASH_3: FLASH.3(W#) ; port WP_FLASH
NetFLASH_5: FLASH.5(SI) ; port SPI1_MOSI
NetFLASH_6: FLASH.6(SCK) ; port SPI1_SCK
NetFLASH_7: FLASH.7(HOLD#) ; port HOLD_FLASH
NetQ1_1: Q1.1(B) R33.2
NetR12_2: R12.2 ; port SPI1_MISO
NetR33_1: R33.1 ; port Buzzer
NetR34_1: R34.1 Y1.1(STANDBY)
NetU1_5: Y1.3(OUTPUT) ; port Clock

### Notes on the sheet
- Buzzer
- Power Supply
- External Clock
- Flash Memory
- Title
- UMSATS - Rocketry Division
- Designed By:
- Size:
- A4
- Number:
- 01
- Revision:
- Date:
- Time:
- Sheet
- of

### Library data of the parts
Buzz1 = PS1240P02BT: Audio Buzzer Piezo 30Vo-p 3Vo-p 70dBA Pin Through Hole T/R; MF: TDK; MP: PS1240P02BT; Price: None; Availability: Unavailable; Package: 2020 TDK; SnapEDA_Link: https://www.snapeda.com/parts/PS1240P02BT/TDK-Lambda%20Americas%20Inc/view-part/?ref=snap; Value: *; Supplier 1: Digi-Key
C1-C3 C20 = Cap: Capacitor; Published: 8-Jun-2000; LatestRevisionDate: 17-Jul-2002; LatestRevisionNote: Re-released for DXP Platform.; Publisher: Altium Limited; Supplier 1: Digi-Key
D1 D4 = MBR0520L: Schottky Diode; Manufacturer: ON Semiconductor / Fairchild; Average Rectified Current: 500mA; Max Reverse Voltage (DC): 20V; Element Configuration: Single; Forward Voltage: 385mV; Max Surge Current: 5.5A; Peak Reverse Current: 250uA; Polarity: Standard; Power Dissipation: 400mW; Capacitance: 4pF; Current Rating: 500A; Manufacturer Part Number: MBR0520L; RoHS: Yes; Mount: Surface Mount; Number of Pins: 2; Weight: 0.03g; Min Operating Temperature: -65°C; Max Operating Temperature: 125°C; Packaging: Tape and Reel; Package Quantity: 3000; Max Forward Surge Current (Ifsm): 5.5A; Forward Current: 500mA; Max Repetitive Reverse Voltage (Vrrm): 20V; Peak Non-Repetitive Surge Current: 5.5A; Max Reverse Leakage Current: 250uA; Voltage Rating (DC): 20V; Output Current: 500mA; Length: 2.7mm; Height: 1.03mm; Width: 1.6mm; Radiation Hardening: No; Lead Free: Lead Free; REACH SVHC: No SVHC; ComponentLink1URL: http://www.farnell.com/datasheets/2304093.pdf?src-supplier=Farnell; ComponentLink1Description: http://www.farnell.com/datasheets/2304093.pdf?src-supplier=Farnell; ComponentLink2URL: http://www.mouser.com/ds/2/149/MBR0520L-67539.pdf?src-supplier=Mouser; ComponentLink2Description: http://www.mouser.com/ds/2/149/MBR0520L-67539.pdf?src-supplier=Mouser; ComponentLink3URL: https://www.fairchildsemi.com/datasheets/MB/MBR0520L.pdf?src-supplier=Digi-Key; ComponentLink3Description: https://www.fairchildsemi.com/datasheets/MB/MBR0520L.pdf?src-supplier=Digi-Key; ComponentLink4URL: https://www.fairchildsemi.com/datasheets/MB/MBR0520L.pdf?src-supplier=Avnet; ComponentLink4Description: https://www.fairchildsemi.com/datasheets/MB/MBR0520L.pdf?src-supplier=Avnet; ComponentLink5URL: http://www.fairchildsemi.com/ds/MB/MBR0520L.pdf?src-supplier=Avnet+Europe; ComponentLink5Description: http://www.fairchildsemi.com/ds/MB/MBR0520L.pdf?src-supplier=Avnet+Europe; ComponentLink6URL: http://www.jameco.com/Jameco/Products/ProdDS/871594.pdf?src-supplier=Jameco; ComponentLink6Description: http://www.jameco.com/Jameco/Products/ProdDS/871594.pdf?src-supplier=Jameco; ComponentLink7URL: http://www.fairchildsemi.com/ds/MB/MBR0520L.pdf?src-supplier=Future+Electronics; ComponentLink7Description: http://www.fairchildsemi.com/ds/MB/MBR0520L.pdf?src-supplier=Future+Electronics; ComponentLink8URL: http://www.farnell.com/datasheets/48015.pdf?src-supplier=Element14; ComponentLink8Description: http://www.farnell.com/datasheets/48015.pdf?src-supplier=Element14; Supplier 1: Digi-Key
FLASH = S25FL064P: MX25L25735F 256 Mb Flash Memory; Supplier 1: Digi-Key
Q1 = CMP-1670-00008-1: NPN General Purpose Amplifier, 40 V, 0.2 A, -55 to 150 degC, 3-Pin SOT23, RoHS, Tape and Reel; Tolerance: 30ppm; Capacitance: 1.8E-11 f; Frequency: 12.288 MHz; ESR: 40 Ohm; Load Capacitance: 18 pF; REACH SVHC: No SVHC; Pins: 4; ComponentLink3URL: http://www.fairchildsemi.com/dwg/MA/MA03D.pdf; PackageDescription: 3-Pin Small Outline Transistor, Body 2.92 x 1.325 mm, Pitch 0.95 mm; ComponentLink1URL: https://www.fairchildsemi.com/; Max Operating Temperature: 70degC; PackageReference: SOT23-3; ComponentLink1Description: Manufacturer URL; Width: 0.126 inch; Min Operating Temperature: -20degC; DatasheetVersion: Rev. 1.1.0, 10/2014; Mount: Surface Mount; Height: 0.041 inch; Package Quantity: 1000; Frequency Tolerance: 30ppm; Packaging: Tape and Reel; ComponentLink2URL: https://www.fairchildsemi.com/datasheets/MM/MMBT3904.pdf; RoHSCompliant: True; ComponentLink3Description: Package Specification; ComponentLink2Description: Datasheet; Length: 0.197 inch; Supplier 1: Digi-Key
R12 R13 R33 R34 = Res1: Resistor; Value: 1K; Published: 8-Jun-2000; LatestRevisionDate: 17-Jul-2002; LatestRevisionNote: Re-released for DXP Platform.; PackageReference: AXIAL-0.3; Publisher: Altium Limited; PackageDescription: Axial Device, Thru-Hole; 2 Leads; 0.3 in Pin Spacing; Supplier 1: Digi-Key
R32 = Res1: Resistor; Published: 8-Jun-2000; LatestRevisionDate: 17-Jul-2002; LatestRevisionNote: Re-released for DXP Platform.; PackageReference: AXIAL-0.3; Publisher: Altium Limited; PackageDescription: Axial Device, Thru-Hole; 2 Leads; 0.3 in Pin Spacing; Value: 1K; Supplier 1: Digi-Key
U2 = TLV75533PDBVR: 500mA Low-IQ Small-Size Low-Dropout _LDO_ Regulator 5-SOT-23 -40 to 125; MF: Texas Instruments; Package: SOT-23 Texas Instruments; MP: TLV75533PDBVR; SnapEDA_Link: https://www.snapeda.com/parts/TLV75533PDBVR/Texas%20Instruments/view-part/?ref=snap; Availability: Unavailable; Price: None; Value: *; Supplier 1: Digi-Key
Y1 = ASEMB-8.000MHZ-XY-T: Crystal or Oscillator; Manufacturer_Name: ABRACON; Datasheet Link: https://abracon.com/Oscillators/ASEMB.pdf; Manufacturer_Part_Number: ASEMB-8.000MHZ-XY-T; Mouser Part Number: 815-ASEMB-8-XY-T; Mouser Price/Stock: https://www.mouser.com/Search/Refine.aspx?Keyword=815-ASEMB-8-XY-T; Supplier 1: Digi-Key

## Nets that join several sheets
3.3V: Controller (17 pins), Sensors (11 pins), Recovery (6 pins), Misc (8 pins)
+5: UART-to-USB (6 pins), Misc (D4.1)
GND: Controller (22 pins), UART-to-USB (8 pins), Sensors (20 pins), Recovery (14 pins), Misc (8 pins)
LiPo: Recovery (13 pins), Misc (Buzz1.P$1 R32.2)
VCC: Recovery (P4.4), Misc (D1.1)
NetComp1_4: Controller (U1.17), Recovery (Comp1.4 R16.1)
NetComp2_4: Controller (U1.40), Recovery (Comp2.4 R25.1)
NetDriver1_1: Controller (U1.16), Recovery (Driver1.1 R20.2)
NetDriver1_2: Controller (U1.15), Recovery (Driver1.2 R14.1)
NetDriver1_3: Controller (U1.14), Recovery (Driver1.3 R15.1)
NetDriver2_1: Controller (U1.41), Recovery (Driver2.1 R29.2)
NetDriver2_2: Controller (U1.42), Recovery (Driver2.2 R23.1)
NetDriver2_3: Controller (U1.43), Recovery (Driver2.3 R24.1)
NetFLASH_1: Controller (U1.25), Misc (FLASH.1 R13.1)
NetFLASH_3: Controller (U1.26), Misc (FLASH.3)
NetFLASH_5: Controller (R2.1), Misc (FLASH.5)
NetFLASH_6: Controller (R1.1), Misc (FLASH.6)
NetFLASH_7: Controller (U1.24), Misc (FLASH.7)
NetP2_2: Controller (P2.2 R3.2), Sensors (PRES.2)
NetP2_3: Controller (P2.3 U1.35), Sensors (R11.1)
NetP2_4: Controller (P2.4 R4.2), Sensors (PRES.4)
NetP3_1: Controller (P3.1 U1.45), UART-to-USB (U9.20)
NetP3_2: Controller (P3.2 U1.44), UART-to-USB (U9.4)
NetPRES_6: Controller (U1.38), Sensors (PRES.6)
NetPRES_7: Controller (U1.37), Sensors (PRES.7)
NetR12_2: Controller (U1.22), Misc (R12.2)
NetR33_1: Controller (U1.28), Misc (R33.1)
NetU1_5: Controller (U1.5), Misc (Y1.3)
NetU1_51: Controller (U1.51), Sensors (U6.7)
NetU1_52: Controller (U1.52), Sensors (U8.2)
NetU1_53: Controller (U1.53), Sensors (U6.6)
NetU1_59: Controller (U1.59), Sensors (U8.3)
NetU1_61: Controller (U1.61), Sensors (U7.7)